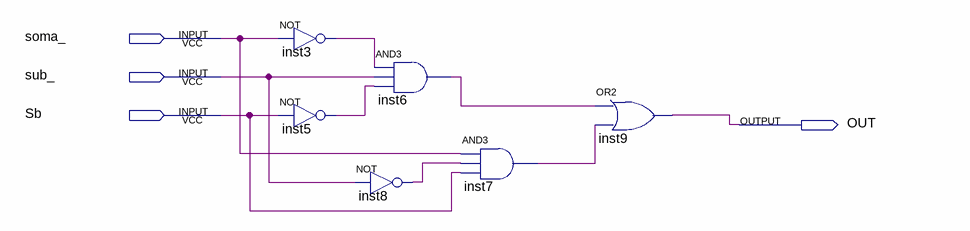
[diagram p0: schematic sheet]
// Quartus schematic subComp2.bdf as structural Verilog: 6 symbols, 4 pins
module subComp2 (
  input  soma_,
  input  sub_,
  input  Sb,
  output OUT
);

  wire inst3_out, inst5_out, inst6_out, inst7_out, inst8_out;

  not inst3 (inst3_out, soma_);
  not inst5 (inst5_out, Sb);
  not inst8 (inst8_out, sub_);
  and inst6 (inst6_out, inst3_out, sub_, inst5_out);
  and inst7 (inst7_out, soma_, inst8_out, Sb);
  or inst9 (OUT, inst6_out, inst7_out);
endmodule
